# Altium schematic sheet 5V_DIMM_VCCO.SchDoc
size A4
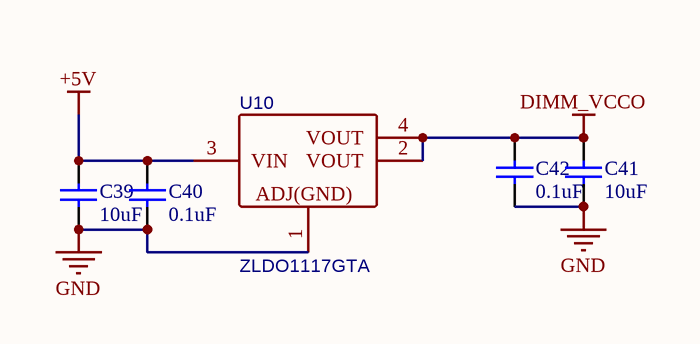
[diagram p0: 5V_DIMM_VCCO.SchDoc]

## Parts
C39  value 10uF  [C1210]  (hidden comment: Cap Semi)
C40  value 0.1uF  [C1210]  (hidden comment: Cap Semi)
C41  value 10uF  [C1210]  (hidden comment: Cap Semi)
C42  value 0.1uF  [C1210]  (hidden comment: Cap Semi)
U10  ZLDO1117GTA  [SOT-223-4_L6.5-W3.5-P2.30-LS7.0-BR]

## Nets
+5V: C39.1 C40.1 U10.3(VIN)
DIMM_VCCO: C41.1 C42.1 U10.2(VOUT) U10.4(VOUT)
GND: C39.2 C40.2 C41.2 C42.2 U10.1(ADJ(GND))

## Library data of the parts
C39-C42 = Cap Semi: Capacitor (Semiconductor SIM Model); Published: 8-Jun-2000; LatestRevisionDate: 29-May-2009; LatestRevisionNote: IPC-7351 Footprint Added.; PackageReference: C1206; Publisher: Altium Limited; PackageDescription: Chip Capacitor
U10 = ZLDO1117GTA: BOM_Manufacturer: Diodes Incorporated; Contributor: LCSC; BOM_Supplier: LCSC; BOM_Supplier Part: C443633; BOM_Manufacturer Part: ZLDO1117GTA; spicePre: U; spiceSymbolName: ZLDO1117GTA